# EAGLE design reflectionSensor (EAGLE 9.1.0)
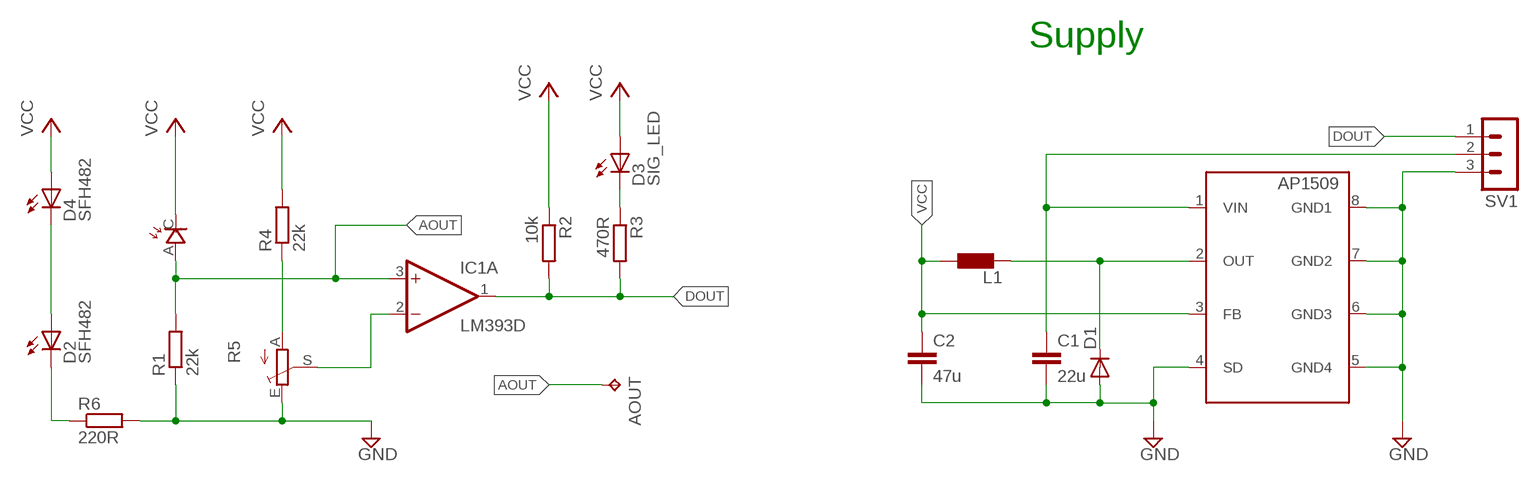
[diagram p0: schematic, sheet 1]

## Parts
AOUT  TPTP20SQ  [TP20SQ]
C1  22u  C-EUC1210  [C1210]
C2  47u  C-EUC1210  [C1210]
D1  DIODE-SOD323-W  [SOD323-W]
D2  SFH482  [SFH482]
D3  SIG_LED  SFH482  [SFH482]
D4  SFH482  [SFH482]
IC1  LM393D  [SO08]
L1  LL5650M  [L5650M]
R1  22k  R-EU_M1206  [M1206]
R2  10k  R-EU_M0805  [M0805]
R3  470R  R-EU_M0805  [M0805]
R4  22k  R-EU_M1206  [M1206]
R5  TRIM_EU-CA9V  [CA9V]
R6  220R  R-EU_M1206  [M1206]
SV1  MA03-1  [MA03-1]
U$1  AP1509  [SOP08]
U$2  PHOTODIODE  [PHOTODIODE]

## Nets
AOUT: AOUT.TP IC1.3(A:+IN) R1.2 U$2.A
DOUT: IC1.1(A:OUT) R2.2 R3.2 SV1.1
GND: C1.2 C2.2 D1.A R1.1 R5.E R6.2 SV1.3 U$1.4(SD) U$1.5(GND4) U$1.6(GND3) U$1.7(GND2) U$1.8(GND1)
N$1: D2.A D4.K(C)
N$2: C1.1 SV1.2 U$1.1(VIN)
N$3: D1.C L1.2 U$1.2(OUT)
N$4: D3.K(C) R3.1
N$5: IC1.2(A:-IN) R5.S
N$6: R4.1 R5.A
N$7: D2.K(C) R6.1
VCC: C2.1 D3.A D4.A L1.1 R2.1 R4.2 U$1.3(FB) U$2.C
Unconnected: IC1.5(B:+IN) IC1.6(B:-IN) IC1.7(B:OUT)

## Notes on the sheet
- Supply

## Power pins joined to a net without a drawn wire
GND: IC1.4(P:V-)
VCC: IC1.8(P:V+)

## Library data of the parts
AOUT = testpad:TP: Test pad
C1 C2 = rcl:C-EU: CAPACITOR, European symbol; SPICEPREFIX: C
D1 = diode:DIODE-: DIODE; TME: BAS3010A03WE6327HT
D2-D4 = led:SFH482: IR LED infrared emitting diode, Infineon
IC1 = linear:LM393: COMPARATOR
L1 = eagle-ltspice:L: INDUCTOR, European symbol; SPICEMODEL: NONE; SPICEPREFIX: L; TME: DJNR4018-470-S
R1 R4 R6 = resistor:R-EU_: RESISTOR, European symbol
R2 R3 = rcl:R-EU_: RESISTOR, European symbol; SPICEPREFIX: R
R5 = pot:TRIM_EU-: POTENTIOMETER
SV1 = con-lstb:MA03-1: PIN HEADER; OC_FARNELL: unknown; OC_NEWARK: unknown
U$1 = AP1509:AP1509
U$2 = photodiode:PHOTODIODE

## Board
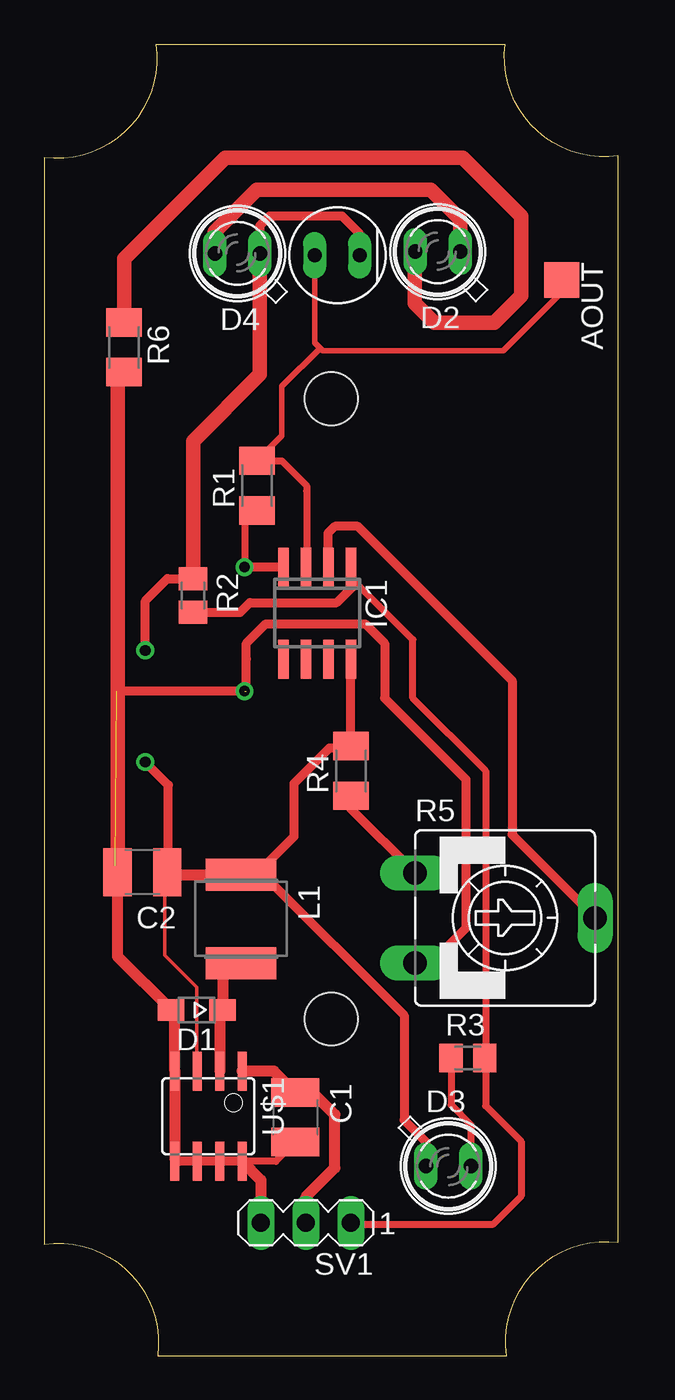
[diagram p1: board, top side]
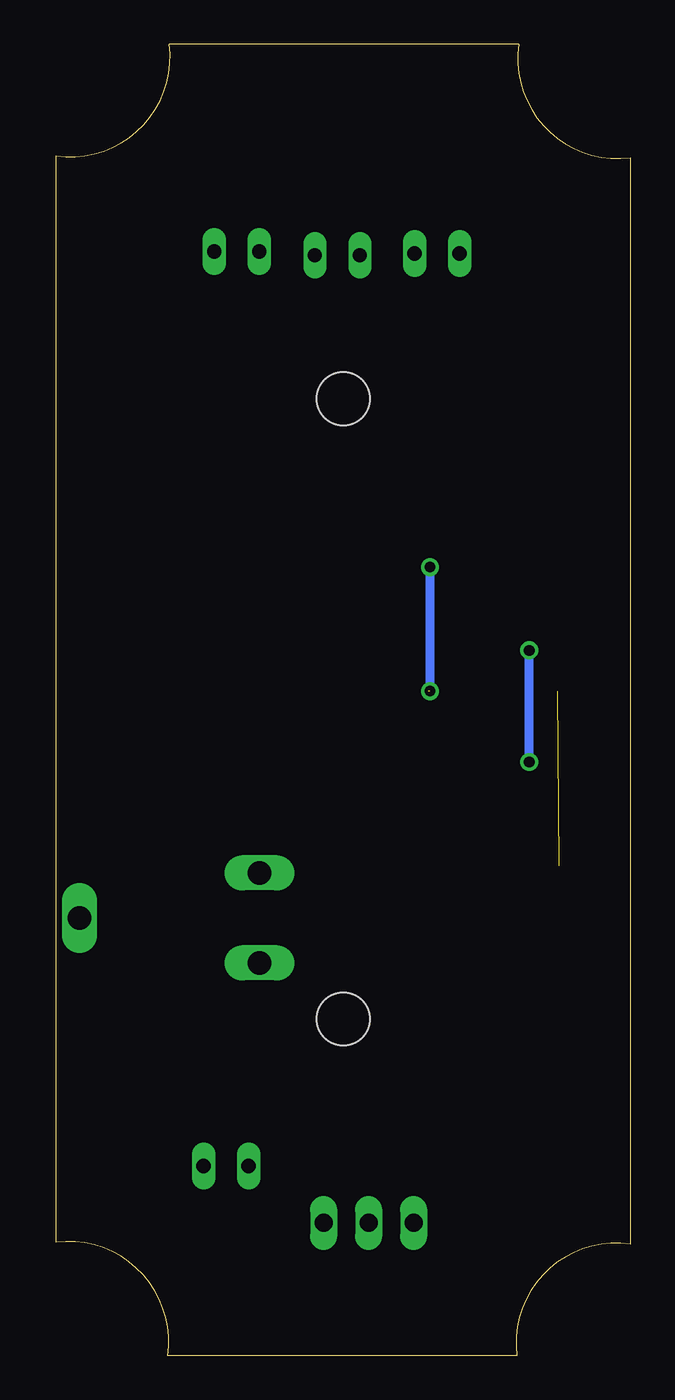
[diagram p2: board, bottom side, seen from below]

Size 32.4 x 74 mm. Coordinates in mm from the lower left corner, seen from the top.
Outline: 32.4,6.4 32.4,67.7 arc-105 26,74 20.4,74 11,74 6.3,74 arc-105 0,67.6 0,19.8 0,6.3 arc-105 6.4,0 26.1,0 arc-105 32.4,6.4
Copper layers (1*16): Top 0.035mm / dielectric 1.5mm / Bottom 0.035mm
Design rules "default": minimum track width 6mil, minimum drill 0.35mm, track to track 6mil, track to pad 6mil, pad to pad 6mil, via to via 6mil, smd to smd 6mil, copper to edge 40mil, drill to drill 6mil, minimum pad ring 10mil, minimum via ring 8mil, stop-mask expansion 4mil, vias tented up to drill 0mil, thermal gap 10mil
Holes 3 mm at 16.2,54 16.2,19

### Footprints (pad centres in the part's own frame; a part is rotated, then mirrored left to right if it is on the bottom)
TP20SQ = smd 2 x 2: TP 0,0
C1210 = smd 1.6 x 2.7: 1 -1.4,0; 2 1.4,0
SOD323-W = smd 1.5 x 1.2: A 1.45,0; C -1.45,0
SFH482 = drill 0.813 long: A -1.27,0; K 1.27,0
SO08 = smd 0.6 x 2.2: 1 -1.905,-2.6; 2 -0.635,-2.6; 3 0.635,-2.6; 4 1.905,-2.6; 5 1.905,2.6; 6 0.635,2.6; 7 -0.635,2.6; 8 -1.905,2.6
L5650M = smd 1.8 x 4: 1 -2.5,0; 2 2.5,0
M1206 = smd 1.6 x 2: 1 -1.4,0; 2 1.4,0
M0805 = smd 1.3 x 1.6: 1 -0.95,0; 2 0.95,0
CA9V = drill 1.321 long: A -2.54,-5.08; E 2.54,-5.08; S 0,5.08
MA03-1 = drill 1.016 long: 1 -2.54,0; 2 0,0; 3 2.54,0
SOP08 = smd 0.5 x 2.2: 1 -1.905,-2.9; 2 -0.645,-2.9; 3 0.625,-2.9; 4 1.895,-2.9; 5 1.905,2.2; 6 0.635,2.2; 7 -0.635,2.2; 8 -1.905,2.2
PHOTODIODE = drill 0.8 long: A 2.54,0; C 0,0

### Placement (x,y rotation side)
AOUT  29.2,60.7 270 top
C1  14.16,13.45 270 top
C2  5.54,27.29 180 top
D1  8.6,19.51 180 top
D2  22.2,62.3 180 top
D3  22.8,10.7 0 top
D4  10.9,62.2 180 top
IC1  15.4,41.9 180 top
L1  11.1,24.65 270 top
R1  12,49.1 90 top
R2  8.4,42.9 270 top
R3  23.9,16.8 0 top
R4  17.3,33 90 top
R5  26,24.7 270 top
R6  4.5,56.9 270 top
SV1  14.76,7.49 180 top
U$1  9.26,13.16 180 top
U$2  17.8,62.1 180 top

### Tracks (layer width: path | path; a pad name or v marks a point on that pad's centre or on a via)
AOUT
  Top 0.305: U$2.A 15.26,57.16 15.56,56.86 | 15.56,56.86 13.4,54.7 13.4,51.9 R1.2 | AOUT.TP 29.2,60 25.9,56.7 15.72,56.7 15.56,56.86
  Top 0.406: 14.8,44.59 14.8,48.8 14.8,49.1 13.4,50.5 R1.2 12.7,50.5
  Top 0.508: IC1.3 14.83,44.56 14.8,44.59
DOUT
  Top 0.406: 17.3,44.1 17.3,43.9 17.6,43.6 20.8,40.4 20.8,37.1 24.9,33 24.9,21.4 24.9,16.7 | 24.9,16.7 24.9,14.1 26.9,12.1 26.9,9 25.3,7.4 17.39,7.4 SV1.1 | R3.2 24.85,16.75 24.9,16.7
  Top 0.508: IC1.1 17.3,44.1 | R2.2 11.05,41.95 11.6,42.5 16.5,42.5 17.6,43.6
GND  (via drill 0.6)  (2 unrouted)
  Top 0.406: 7.4,16.6 7.37,16.6 7.37,16.3 U$1.4 7.37,15.8 7.37,10.96 U$1.5 | C1.2 14.05,11.95 13.07,10.96 U$1.8 | R1.1 11.3,47 v11.3,44.5
  Top 0.508: U$1.8 U$1.7 U$1.6 7.5,10.96 U$1.5 | C2.2 4.14,27.5 | R5.E 21.8,22.16 23.8,24.16 23.8,32.5 19.2,37.1 19.2,40.2 18.1,41.3 12.5,41.3 11.4,40.2 11.4,39.3 11.4,37.5 | v11.3,44.5 IC1.4 | v11.3,37.5 4.1,37.5
  Top 0.61: D1.A 4.14,22.52 C2.2 4.42,27.57 | D1.A 7.57,19.09 | 7.5,10.96 7.37,11.1 U$1.4 7.37,19.3 arc90 D1.A | U$1.8 12.22,9.9 SV1.3
  Top 0.813: 4.14,27.5 4.04,27.6 4,27.64 | C2.2 4.14,55.14 R6.2
  Bottom 0.508: v11.3,44.5 v11.3,37.5
N$1
  Top 0.61: 23.4,62.37 D2.A
  Top 0.813: D2.A 23.47,64.13 21.8,65.8 12,65.8 9.63,63.43 D4.K
N$2
  Top 0.61: SV1.2 14.76,8.96 16.4,10.6 16.4,13.6 15.15,14.85 C1.1 12.95,16.06 U$1.1
N$3
  Top 0.406: L1.2 11.01,22.36 10.45,22.36 10.3,22.5 10.11,22.3
  Top 0.61: 10.11,22.3 10.11,19.57 D1.C arc90 9.9,19.36 U$1.2
N$4
  Top 0.406: R3.1 22.95,14.15 24.07,13.03 D3.K
N$5
  Top 0.508: 16.04,43.47 16.04,44 | 16.04,44 IC1.2 | 19.7,44.8 19.45,45.05 | 19.45,45.05 17.7,46.8 16.4,46.8 16,46.4 16,45.2 16.04,45.16 16.04,44 | 19.45,45.05 26.4,38.1 26.4,29.4 31.08,24.72 R5.S
N$6
  Top 0.508: R4.1 17.3,30.86 R5.A
N$7
  Top 0.813: R6.1 4.5,61.9 10.2,67.6 23.6,67.6 26.9,64.3 26.9,59.8 25.4,58.3 22,58.3 20.9,59.4 20.9,62.27 D2.K
VCC  (via drill 0.6)
  Top 0.2: U$1.3 8.6,16.09 8.6,20.8 6.8,22.6 6.8,27.15 C2.1
  Top 0.254: U$1.3 8.63,15.23
  Top 0.508: 7,27.29 7,32.2 v5.7,33.5 | v5.7,39.8 5.7,42.6 6.95,43.85 R2.1 | D3.A 21.53,12.07 20.3,13.3 20.3,19.2 12.35,27.15 L1.1 11.65,26.85 14.1,29.3 14.1,32.3 16.1,34.3 17.2,34.3 R4.2 IC1.8 | 12.35,26.85 11.4,26.85 | 6.9,27.25 C2.1 | U$2.C 17.8,63.3 16.8,64.3 12.7,64.3 12.17,63.77 D4.A
  Top 0.61: 6.9,27.25 6.91,27.15 L1.1 11.4,26.85 11.9,26.85 | C2.1 7,27.29
  Top 0.813: R2.1 8.4,51.6 12.17,55.37 D4.A | U$2.C 17.8,62.9
  Bottom 0.508: v5.7,33.5 v5.7,39.8